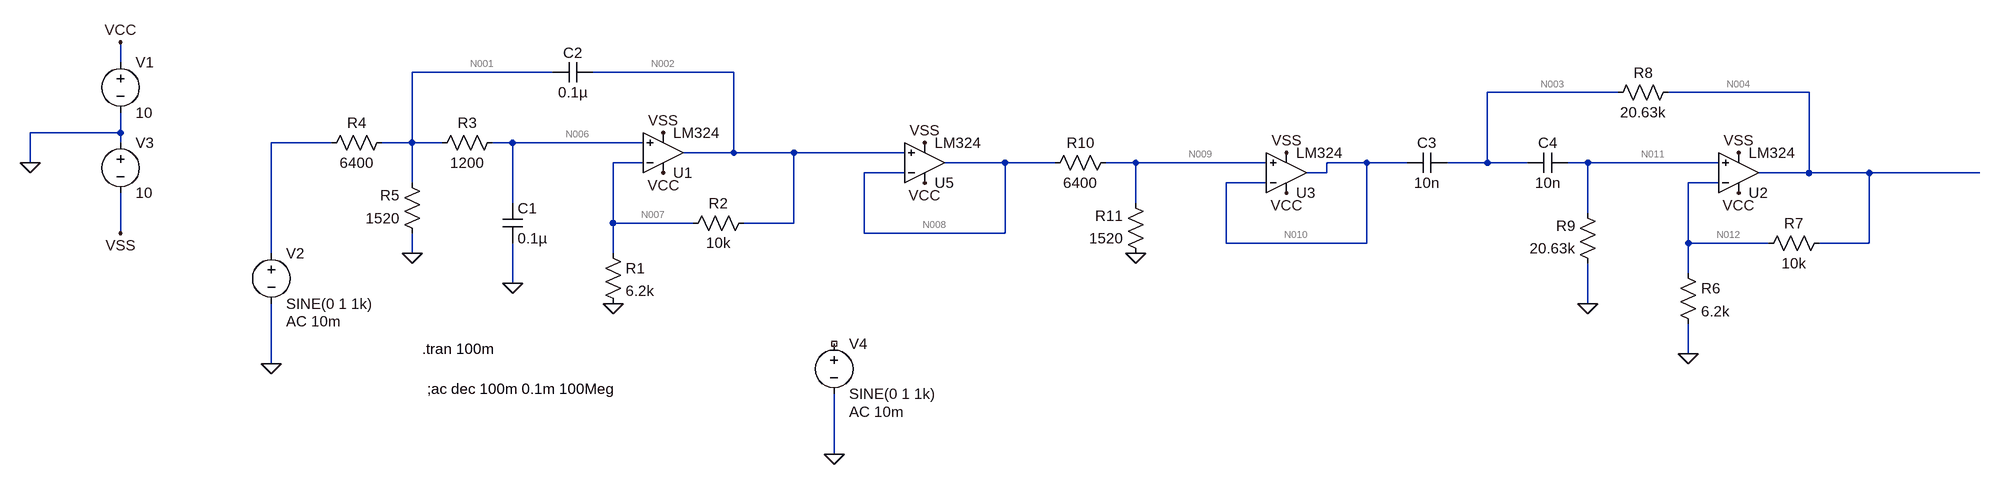
[diagram p0: schematic simulacion1_v0.asc]
* simulacion1_v0.asc
* U1: LM324 (symbol AutoGenerated\LM324 not available, pins judged from their places): In+=N006 In-=N007 V+=VCC V-=VSS OUT=N002
V1 VCC 0 10
R1 N007 0 6.2k
R2 N002 N007 10k
V2 N005 0 SINE(0 1 1k) AC 10m
V3 0 VSS 10
C1 N006 0 0.1µ
R3 N006 N001 1200
R4 N001 N005 6400
C2 N002 N001 0.1µ
R5 0 N001 1520
* U2: LM324 (symbol AutoGenerated\LM324 not available, pins judged from their places): In+=N011 In-=N012 V+=VCC V-=VSS OUT=N004
R6 N012 0 6.2k
R7 N004 N012 10k
V4 NC_01 0 SINE(0 1 1k) AC 10m
R8 N004 N003 20.63k
R9 0 N011 20.63k
C3 N003 N010 10n
C4 N011 N003 10n
R10 N009 N008 6400
R11 0 N009 1520
* U3: LM324 (symbol AutoGenerated\LM324 not available, pins judged from their places): In+=N009 In-=N010 V+=VCC V-=VSS OUT=N010
* U5: LM324 (symbol AutoGenerated\LM324 not available, pins judged from their places): In+=N002 In-=N008 V+=VCC V-=VSS OUT=N008
.tran 100m
;ac dec 100m 0.1m 100Meg
.backanno
.end

* Results of the author's LTspice run, read from the files saved beside the schematic
* Operating Point, zero values left out:
*   V(n002) = -160.9 µV
*   V(vss) = -10 V
*   V(vcc) = 10 V
*   V(n007) = 14.72 µV
*   V(n006) = 48.38 µV
*   V(n001) = 24.47 µV
*   V(n004) = 786.5 µV
*   V(n012) = 377.3 µV
*   V(n011) = 411 µV
*   V(n003) = 786.5 µV
*   V(n010) = -46.53 µV
*   V(n009) = -12.87 µV
*   V(n008) = -194.6 µV
*   I(R11) = 8.468 nA
*   I(R10) = 28.39 nA
*   I(R9) = -19.92 nA
*   I(R7) = 40.92 nA
*   I(R6) = 60.86 nA
*   I(R5) = -16.1 nA
*   I(R4) = 3.824 nA
*   I(R3) = 19.92 nA
*   I(R2) = -17.57 nA
*   I(R1) = 2.374 nA
*   I(V3) = -2.679 mA
*   I(V2) = 3.824 nA
*   I(V1) = -2.68 mA
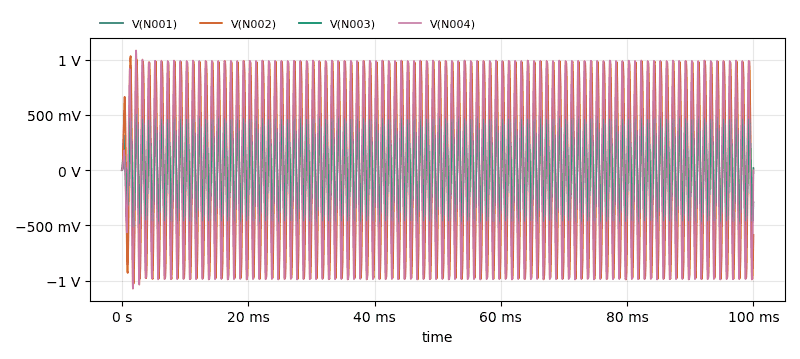
[diagram p1: Transient Analysis of simulacion1_v0.asc, plotted from the saved traces]
* Transient Analysis, 1 run:
*   V(N001): min -516.1 mV, max 521.8 mV, average -437.5 µV, rms 340.3 mV, last 18.46 mV
*   V(N002): min -1.029 V, max 1.032 V, average -666.5 µV, rms 702 mV, last -585.6 mV
*   V(N003): min -513.9 mV, max 499.4 mV, average 190.4 µV, rms 330.4 mV, last -290.1 mV
*   V(N004): min -1.074 V, max 1.083 V, average -774.6 µV, rms 690.8 mV, last -572.9 µV